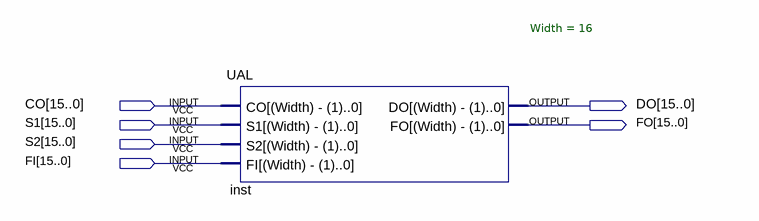
[diagram p0: schematic sheet]
// Quartus schematic CPU.bdf as structural Verilog: 1 symbols, 6 pins
module CPU (
  input  [15:0] CO,
  input  [15:0] S1,
  input  [15:0] S2,
  input  [15:0] FI,
  output [15:0] DO,
  output [15:0] FO
);

  UAL #(.Width(16)) inst (.CO(CO), .S1(S1), .S2(S2), .FI(FI), .DO(DO), .FO(FO));
endmodule
